# Altium schematic sheet powerSupply.SchDoc
size A4; SheetNumber: 3; SheetTotal: 4
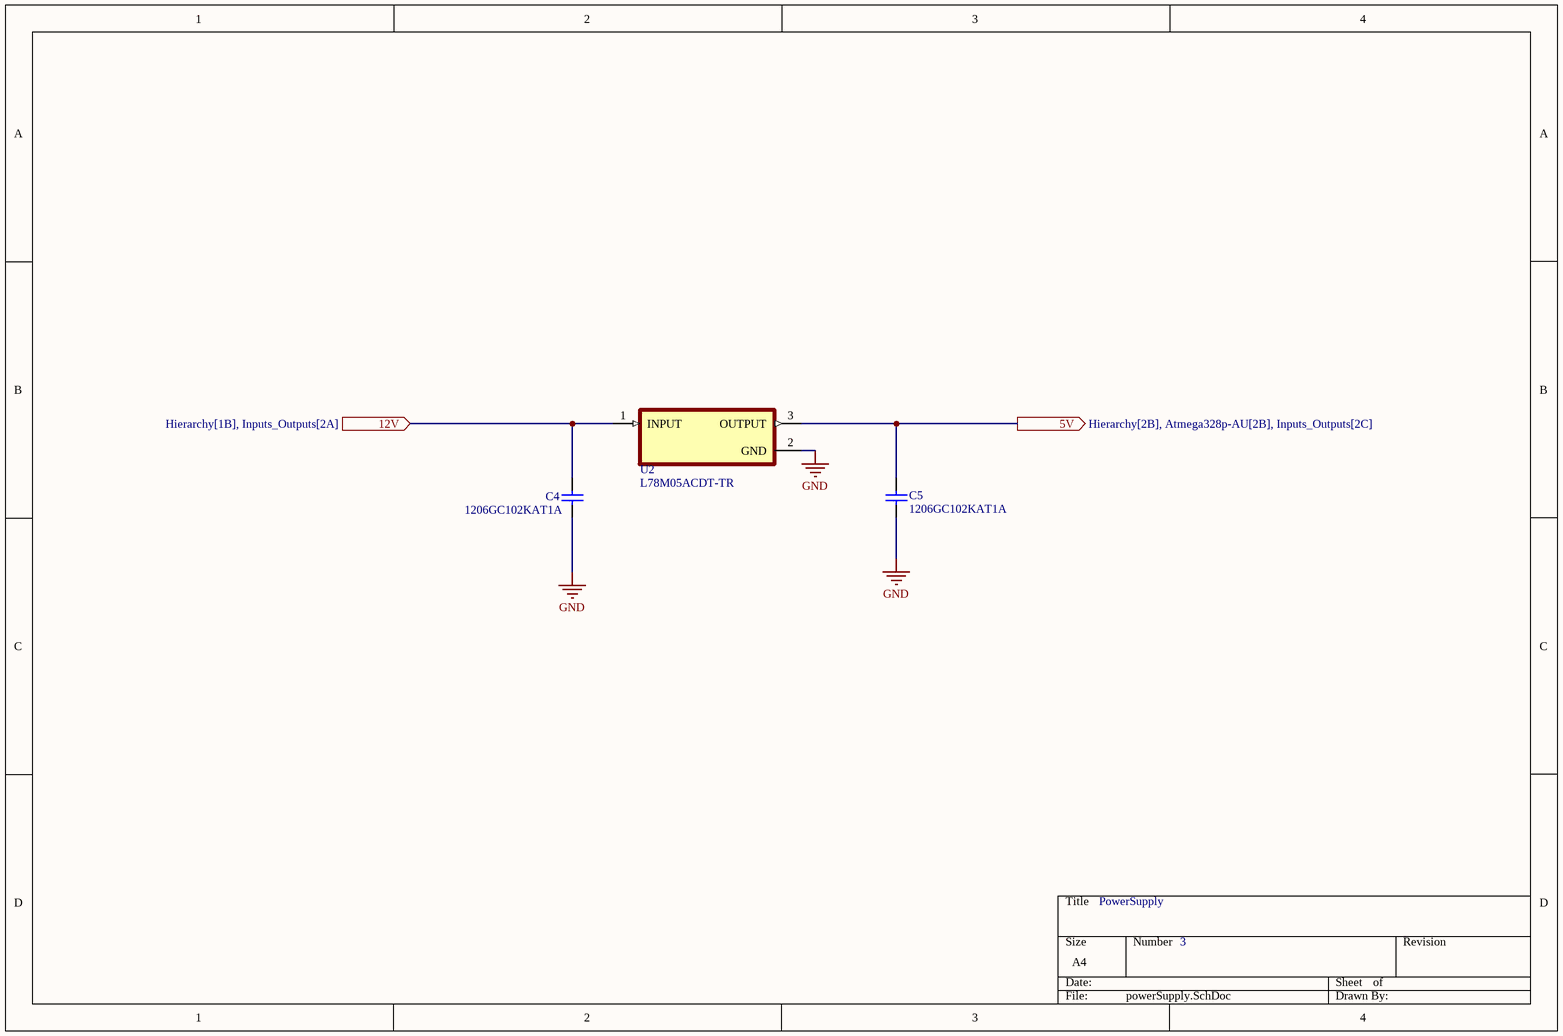
[diagram p0: powerSupply.SchDoc]

## Parts
C4  1206GC102KAT1A  [AVX-1206-2_L]
C5  1206GC102KAT1A  [AVX-1206-2_L]
U2  L78M05ACDT-TR  [DPAK228P972X240-4N]

## Ports
5V (out, see Hierarchy[2B], Atmega328p-AU[2B], Inputs_Outputs[2C]), 12V (in, see Hierarchy[1B], Inputs_Outputs[2A])

## Nets
GND: C4.1 C5.2 U2.2(GND)
5V: C5.1 U2.3(OUTPUT) ; port 5V
12V: C4.2 U2.1(INPUT) ; port 12V

## Notes on the sheet
- PowerSupply
- 3

## Library data of the parts
C4 C5 = CMP-2000-05468-1: Chip Capacitor, 1 nF, +/- 10%, -55 to 125 degC, 1206 (3216 Metric), RoHS, Tape and Reel; Manufacturer: AVX; Capacitance: 0.001uF; Dielectric: X7R; Voltage Rating DC: 2000V; Package Reference: 1206; Datasheet Version: 11/2010; Mounting Technology: SurfaceMount; Manufacturer URL: http://www.avx.com/; Tolerance: 10%; Tolerance (%): ±10%; PartNumber: 1206GC102KAT1A; Datasheet URL: https://datasheet.ciiva.com/11787/0900766b80ed4c37-11787781.pdf; Package Description: 2-Pin SMD, Body 3.4 x 1.8 mm; Case Size/Dimension: 1206; Rated Voltage: 2000V
U2 = L78M05ACDT-TR: Linear Voltage Regulator IC 1 Output 500mA DPAK; MF: STMicroelectronics; Availability: Unavailable; MP: L78M05ACDT-TR; Price: None; Value: *; SnapEDA_Link: https://www.snapeda.com/parts/L78M05ACDT-TR/STMicroelectronics/view-part/274303/?ref=snap; Package: TO-252-3 STMicroelectronics